# Altium schematic sheet Altium_1_v01_Cartridge_Breakout.schdoc
size 302 x 215 mm; Name: A_A4; Symbol: A_A4; Device: A_A4; @Project Name: 64by; REV: v01; Date: 2024-05-09; Sheet: 1/1; Draw By: OsoLabs.tech; Company: OsoLabs.tech; Convert to PCB: yes; Add into BOM: yes; @Page No: 1; @Page Count: 1; @Schematic Name: v01_Cartridge_Breakout; @Board Name: v01_Cartridge_Breakout; @Update Date: 2024-05-28; @Create Time: 19:48:24; @Update Time: 15:30:46; @Page Name: v01_Cartridge_Breakout; @Create Date: 2024-05-24
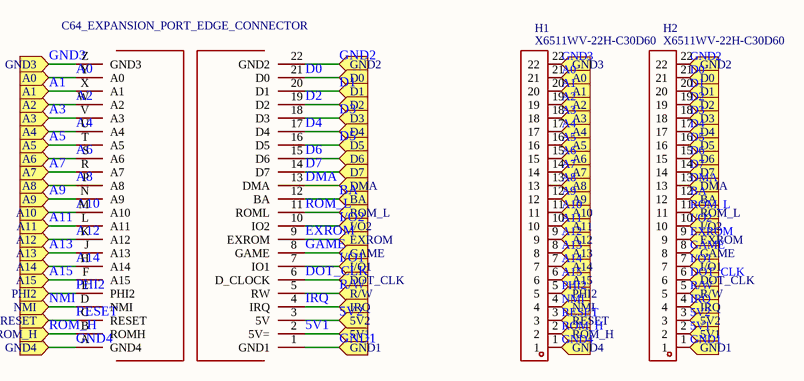
[diagram p0: Altium_1_v01_Cartridge_Breakout.schdoc]

## Parts
H1  X6511WV-22H-C30D60  [HDR-TH_22P-P2.54-V-M]
H2  X6511WV-22H-C30D60  [HDR-TH_22P-P2.54-V-M]
U1  C64_EXPANSION_PORT_EDGE_CONNECTOR

## Ports
5V1 (in), 5V2 (in), A0 (in), A1 (in), A2 (in), A3 (in), A4 (in), A5 (in), A6 (in), A7 (in), A8 (in), A9 (in), A10 (in), A11 (in), A12 (in), A13 (in), A14 (in), A15 (in), BA (in), D0 (in), D1 (in), D2 (in), D3 (in), D4 (in), D5 (in), D6 (in), D7 (in), DMA (in), DOT_CLK (in), EXROM (in), GAME (in), GND1 (in), GND2 (in), GND3 (in), GND4 (in), I/O1 (in), I/O2 (in), IRQ (in), NMI (in), PHI2 (in), R/W (in), RESET (in), ROM_H (in), ROM_L (in)

## Nets
5V1: H2.2 U1.2(5V=) ; port 5V1
5V2: H2.3 U1.3(5V) ; port 5V2
A0: H1.21 U1.Y(A0) ; port A0
A1: H1.20 U1.X(A1) ; port A1
A2: H1.19 U1.W(A2) ; port A2
A3: H1.18 U1.V(A3) ; port A3
A4: H1.17 U1.U(A4) ; port A4
A5: H1.16 U1.T(A5) ; port A5
A6: H1.15 U1.S(A6) ; port A6
A7: H1.14 U1.R(A7) ; port A7
A8: H1.13 U1.P(A8) ; port A8
A9: H1.12 U1.N(A9) ; port A9
A10: H1.11 U1.M(A10) ; port A10
A11: H1.10 U1.L(A11) ; port A11
A12: H1.9 U1.K(A12) ; port A12
A13: H1.8 U1.J(A13) ; port A13
A14: H1.7 U1.H(A14) ; port A14
A15: H1.6 U1.F(A15) ; port A15
BA: H2.12 U1.12(BA) ; port BA
D0: H2.21 U1.21(D0) ; port D0
D1: H2.20 U1.20(D1) ; port D1
D2: H2.19 U1.19(D2) ; port D2
D3: H2.18 U1.18(D3) ; port D3
D4: H2.17 U1.17(D4) ; port D4
D5: H2.16 U1.16(D5) ; port D5
D6: H2.15 U1.15(D6) ; port D6
D7: H2.14 U1.14(D7) ; port D7
DMA: H2.13 U1.13(DMA) ; port DMA
DOT_CLK: H2.6 U1.6(D_CLOCK) ; port DOT_CLK
EXROM: H2.9 U1.9(EXROM) ; port EXROM
GAME: H2.8 U1.8(GAME) ; port GAME
GND1: H2.1 U1.1(GND1) ; port GND1
GND2: H2.22 U1.22(GND2) ; port GND2
GND3: H1.22 U1.Z(GND3) ; port GND3
GND4: H1.1 U1.A(GND4) ; port GND4
I/O1: H2.7 U1.7(IO1) ; port I/O1
I/O2: H2.10 U1.10(IO2) ; port I/O2
IRQ: H2.4 U1.4(IRQ) ; port IRQ
NMI: H1.4 U1.D(NMI) ; port NMI
PHI2: H1.5 U1.E(PHI2) ; port PHI2
R/W: H2.5 U1.5(RW) ; port R/W
RESET: H1.3 U1.C(RESET) ; port RESET
ROM_H: H1.2 U1.B(ROMH) ; port ROM_H
ROM_L: H2.11 U1.11(ROML) ; port ROM_L

## Notes on the sheet
- 1
- 2
- 3
- 4
- 5
- A
- B
- C
- D
- TITLE:
- 64by
- REV:
- v01
- Date:
- Company:
- 2024-05-09
- OsoLabs.tech
- Drawn By:
- Sheet:
- 1/1
- v01_Cartridge_Breakout

## Library data of the parts
H1 H2 = X6511WV-22H-C30D60: Manufacturer: XKB Connection(中国星坤); Manufacturer Part: X6511WV-22H-C60D30; Add into BOM: yes; Symbol: X6511WV-22H-C30D60; Device: X6511WV-22H-C30D60; Supplier: LCSC; Supplier Part: C725954; JLCPCB Part Class: Extended Part; Convert to PCB: yes; Origin Footprint: HDR-TH_22P-P2.54-V-M
U1 = C64_EXPANSION_PORT_EDGE_CONNECTOR: Convert to PCB: yes; Origin Footprint: CARTRIDGE; Symbol: C64_EXPANSION_PORT_EDGE_CONNECTOR; Device: C64_EXPANSION_PORT_EDGE_CONNECTOR; Manufacturer Part: ?; Add into BOM: yes